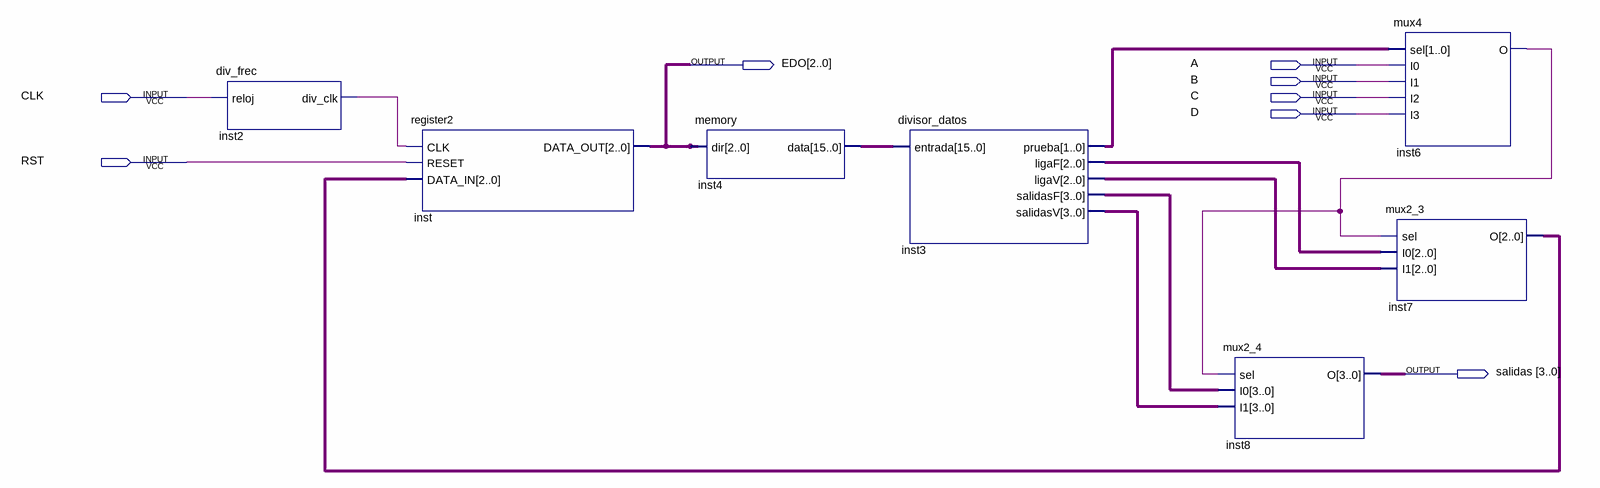
[diagram p0: schematic sheet]
// Quartus schematic practica4.bdf as structural Verilog: 7 symbols, 8 pins
module practica4 (
  input  A,
  input  B,
  input  CLK,
  input  C,
  input  D,
  input  RST,
  output [2:0] EDO,
  output [3:0] salidas
);

  wire inst2_div_clk, inst6_o;
  wire [1:0] inst3_prueba;
  wire [2:0] inst3_ligaf, inst3_ligav, inst7_o;
  wire [3:0] inst3_salidasf, inst3_salidasv;
  wire [15:0] inst4_data;

  div_frec inst2 (.reloj(CLK), .div_clk(inst2_div_clk));
  register2 inst (.CLK(inst2_div_clk), .RESET(RST), .DATA_IN(inst7_o), .DATA_OUT(EDO));
  memory inst4 (.dir(EDO), .data(inst4_data));
  divisor_datos inst3 (
    .entrada(inst4_data), .prueba(inst3_prueba), .ligaF(inst3_ligaf), .ligaV(inst3_ligav),
    .salidasF(inst3_salidasf), .salidasV(inst3_salidasv));
  mux2_4 inst8 (.sel(inst6_o), .I0(inst3_salidasf), .I1(inst3_salidasv), .O(salidas));
  mux4 inst6 (.sel(inst3_prueba), .I0(A), .I1(B), .I2(C), .I3(D), .O(inst6_o));
  mux2_3 inst7 (.sel(inst6_o), .I0(inst3_ligaf), .I1(inst3_ligav), .O(inst7_o));
endmodule
